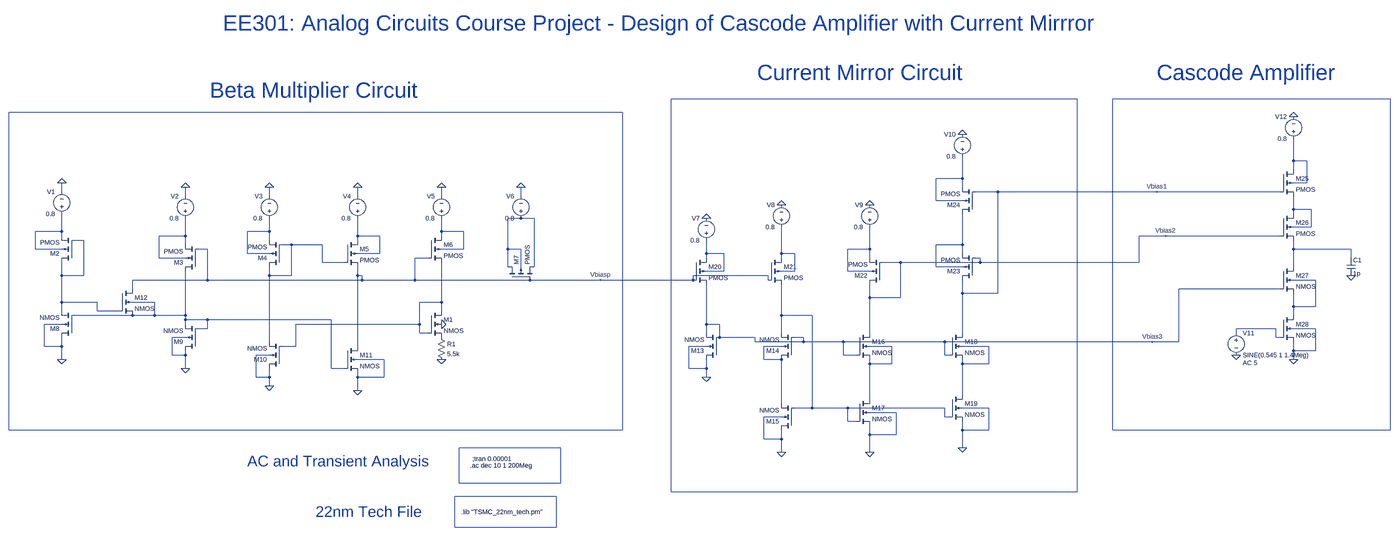
[diagram p0: schematic Cascode_Amplifier_Schematic_180nm.asc, whole sheet]
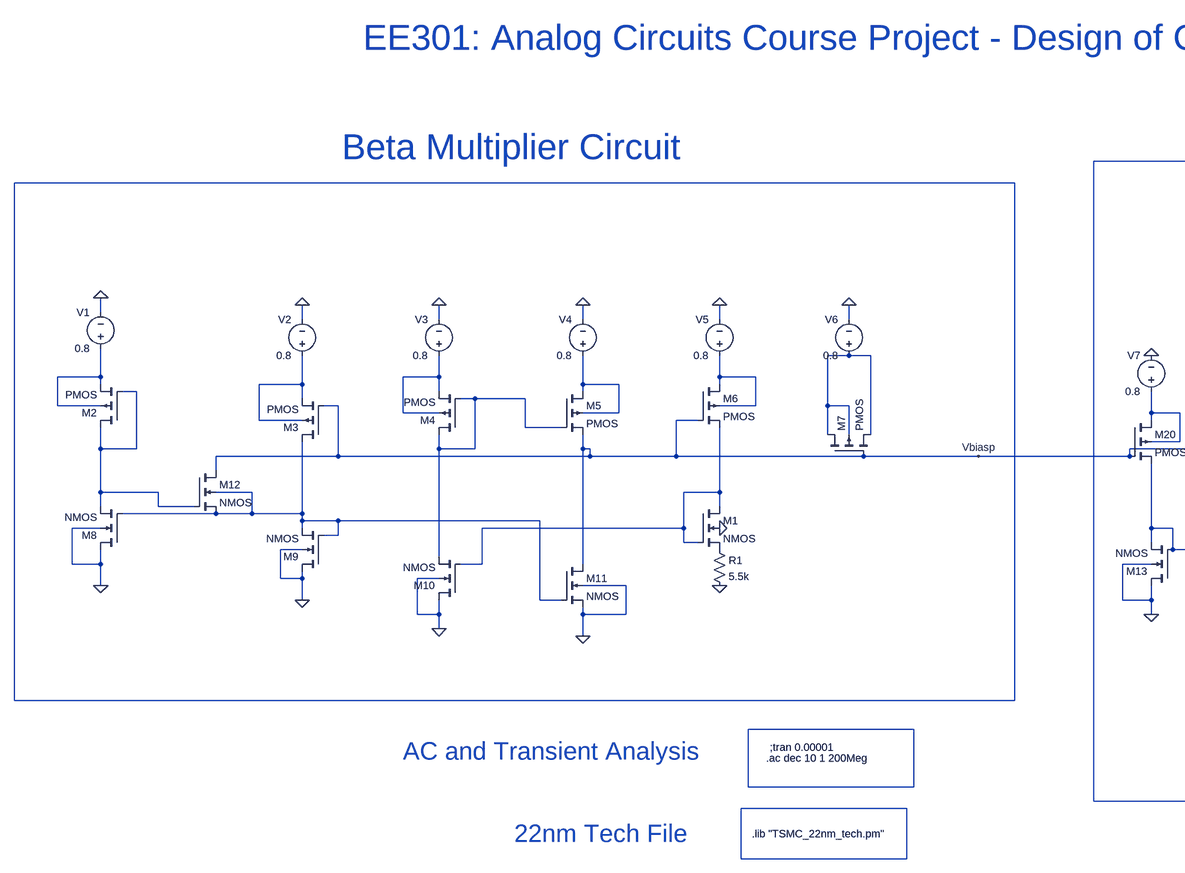
[diagram p1: schematic Cascode_Amplifier_Schematic_180nm.asc, part, row 1 of 1, column 1 of 2]
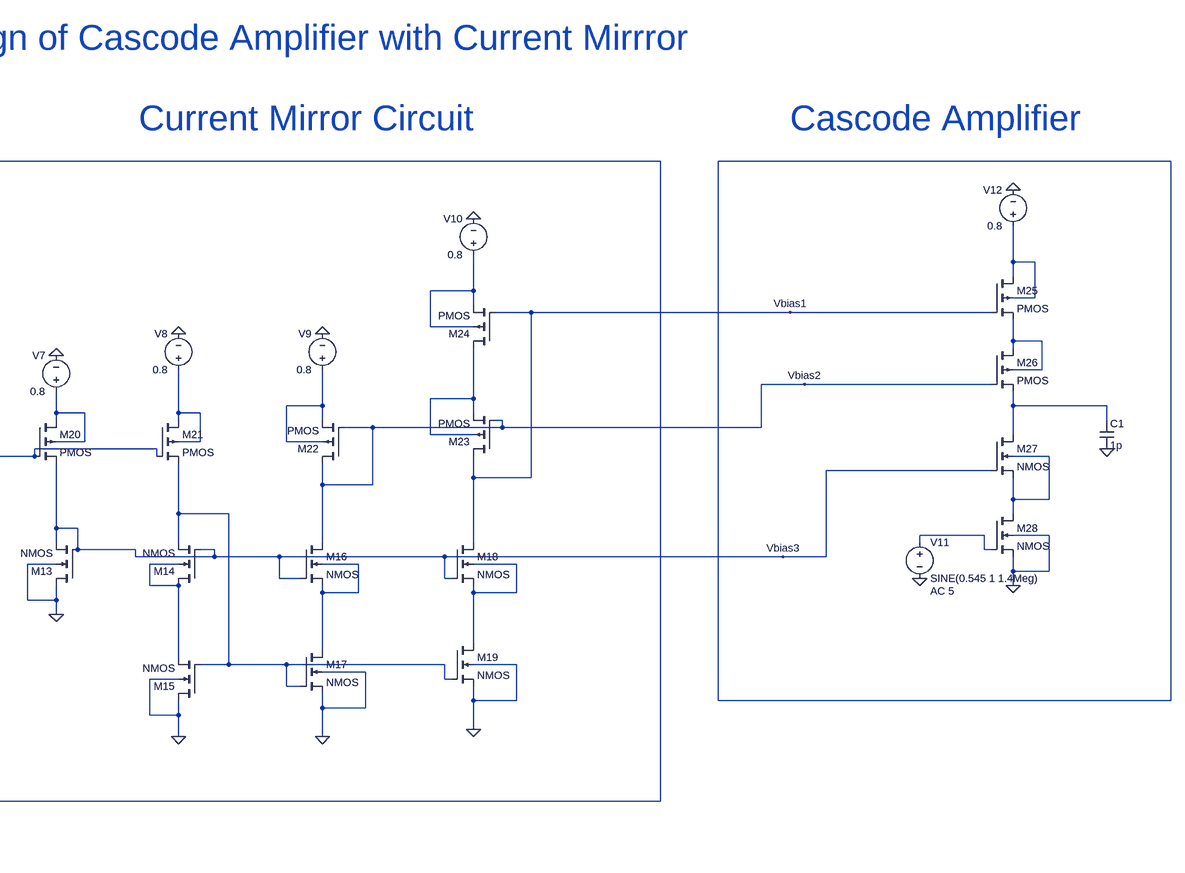
[diagram p2: schematic Cascode_Amplifier_Schematic_180nm.asc, part, row 1 of 1, column 2 of 2]
Cascode_Amplifier_Schematic_180nm.asc, the LTspice schematic file:
Version 4
SHEET 1 2628 1124
WIRE 1456 -432 -16 -432
WIRE 2624 -432 1584 -432
WIRE -192 -384 -2416 -384
WIRE 2240 -208 2240 -288
WIRE 2288 -208 2240 -208
WIRE 2240 -176 2240 -208
WIRE 1040 -144 1040 -224
WIRE 1040 -144 944 -144
WIRE 2288 -128 2288 -208
WIRE 2288 -128 2240 -128
WIRE 1040 -112 1040 -144
WIRE -2224 -96 -2224 -128
WIRE 1168 -96 1088 -96
WIRE 1744 -96 1168 -96
WIRE 2192 -96 1744 -96
WIRE -1776 -80 -1776 -112
WIRE -1472 -80 -1472 -112
WIRE -1152 -80 -1152 -112
WIRE -848 -80 -848 -112
WIRE -560 -80 -560 -112
WIRE 944 -64 944 -144
WIRE 1040 -64 944 -64
WIRE 2240 -32 2240 -80
WIRE 2304 -32 2240 -32
WIRE 2240 -16 2240 -32
WIRE -560 0 -608 0
WIRE -512 0 -560 0
WIRE 2304 32 2304 -32
WIRE 2304 32 2240 32
WIRE -2224 48 -2224 -16
WIRE -2224 48 -2320 48
WIRE -1472 48 -1472 0
WIRE -1472 48 -1552 48
WIRE -848 48 -848 0
WIRE -768 48 -848 48
WIRE -2224 64 -2224 48
WIRE -1776 64 -1776 0
WIRE -1776 64 -1872 64
WIRE -1152 64 -1152 0
WIRE -1072 64 -1152 64
WIRE -848 64 -848 48
WIRE 1776 64 1680 64
WIRE 2192 64 1776 64
WIRE -2144 80 -2176 80
WIRE -1472 80 -1472 48
WIRE -1152 80 -1152 64
WIRE -1776 96 -1776 64
WIRE -1392 96 -1424 96
WIRE -1280 96 -1392 96
WIRE 1040 96 1040 -16
WIRE 1040 96 944 96
WIRE -2320 112 -2320 48
WIRE -2224 112 -2320 112
WIRE -1696 112 -1728 112
WIRE -768 112 -768 48
WIRE -768 112 -848 112
WIRE -608 112 -608 0
WIRE -560 112 -608 112
WIRE 704 112 704 32
WIRE 704 112 624 112
WIRE 2240 112 2240 80
WIRE 2448 112 2240 112
WIRE -1552 128 -1552 48
WIRE -1472 128 -1552 128
WIRE -1072 128 -1072 64
WIRE -1072 128 -1152 128
WIRE 112 128 112 80
WIRE 176 128 112 128
WIRE 384 128 384 32
WIRE 432 128 384 128
WIRE 1040 128 1040 96
WIRE -1872 144 -1872 64
WIRE -1776 144 -1872 144
WIRE -896 144 -944 144
WIRE 112 144 112 128
WIRE 384 144 384 128
WIRE 704 144 704 112
WIRE 1104 144 1088 144
WIRE 2448 144 2448 112
WIRE -1280 160 -1280 96
WIRE -1200 160 -1280 160
WIRE 816 160 752 160
WIRE 1104 160 1104 144
WIRE 1104 160 816 160
WIRE 1680 160 1680 64
WIRE 1680 160 1104 160
WIRE -608 176 -608 112
WIRE -560 176 -560 112
WIRE -512 176 -512 0
WIRE 944 176 944 96
WIRE 1040 176 944 176
WIRE 2240 176 2240 112
WIRE 176 192 176 128
WIRE 176 192 112 192
WIRE 432 192 432 128
WIRE 432 192 384 192
WIRE 624 192 624 112
WIRE 704 192 624 192
WIRE -2224 208 -2224 160
WIRE -2144 208 -2144 80
WIRE -2144 208 -2224 208
WIRE -1472 208 -1472 176
WIRE -1392 208 -1392 96
WIRE -1392 208 -1472 208
WIRE -1152 208 -1152 176
WIRE -1136 208 -1152 208
WIRE 336 208 64 208
WIRE -1696 224 -1696 112
WIRE -1696 224 -1968 224
WIRE -1136 224 -1136 208
WIRE -1136 224 -1696 224
WIRE -944 224 -944 144
WIRE -944 224 -1136 224
WIRE -528 224 -944 224
WIRE -272 224 -528 224
WIRE 64 224 64 208
WIRE 64 224 -272 224
WIRE 336 224 336 208
WIRE 2320 224 2240 224
WIRE -1968 256 -1968 224
WIRE 2192 256 1824 256
WIRE 1040 272 1040 224
WIRE 1168 272 1168 -96
WIRE 1168 272 1040 272
WIRE 704 288 704 240
WIRE 816 288 816 160
WIRE 816 288 704 288
WIRE -2224 304 -2224 208
WIRE -2096 304 -2224 304
WIRE -1888 304 -1968 304
WIRE -848 304 -848 160
WIRE -848 304 -928 304
WIRE 2240 320 2240 272
WIRE 2320 320 2320 224
WIRE 2320 320 2240 320
WIRE -2224 336 -2224 304
WIRE -2096 336 -2096 304
WIRE -2016 336 -2096 336
WIRE -848 336 -848 304
WIRE -1968 352 -2176 352
WIRE -1888 352 -1888 304
WIRE -1888 352 -1968 352
WIRE -1776 352 -1776 192
WIRE -1776 352 -1888 352
WIRE 384 352 384 240
WIRE 496 352 384 352
WIRE 2240 352 2240 320
WIRE -1776 368 -1776 352
WIRE -1696 368 -1776 368
WIRE -1248 368 -1696 368
WIRE -2224 384 -2288 384
WIRE -1776 384 -1776 368
WIRE -928 384 -928 304
WIRE -928 384 -1376 384
WIRE 112 384 112 240
WIRE 160 384 112 384
WIRE -1696 400 -1696 368
WIRE -1696 400 -1728 400
WIRE 2176 400 2032 400
WIRE 2320 400 2240 400
WIRE -928 416 -928 384
WIRE -896 416 -928 416
WIRE 112 416 112 384
WIRE 384 416 384 352
WIRE 704 416 704 288
WIRE 1040 416 1040 272
WIRE 2032 416 2032 400
WIRE -1776 432 -1824 432
WIRE 160 432 160 384
WIRE 288 432 160 432
WIRE 464 432 432 432
WIRE 2176 432 2176 400
WIRE 2192 432 2176 432
WIRE -1472 448 -1472 208
WIRE 288 448 288 432
WIRE 464 448 464 432
WIRE 464 448 288 448
WIRE 608 448 464 448
WIRE 976 448 608 448
WIRE 1728 448 976 448
WIRE 1824 448 1824 256
WIRE 1824 448 1728 448
WIRE -2288 464 -2288 384
WIRE -2224 464 -2224 432
WIRE -2224 464 -2288 464
WIRE -1376 464 -1376 384
WIRE -1376 464 -1424 464
WIRE -1152 464 -1152 208
WIRE 112 464 48 464
WIRE 384 464 320 464
WIRE 784 464 704 464
WIRE 1136 464 1040 464
WIRE 2240 480 2240 448
WIRE 2320 480 2320 400
WIRE 2320 480 2240 480
WIRE -1824 496 -1824 432
WIRE -1776 496 -1776 480
WIRE -1776 496 -1824 496
WIRE -1472 496 -1520 496
WIRE 608 496 608 448
WIRE 656 496 608 496
WIRE 976 496 976 448
WIRE 992 496 976 496
WIRE -2224 512 -2224 464
WIRE -1056 512 -1152 512
WIRE 320 512 320 464
WIRE 384 512 320 512
WIRE 2240 512 2240 480
WIRE 704 528 704 512
WIRE 784 528 784 464
WIRE 784 528 704 528
WIRE 1040 528 1040 512
WIRE 1136 528 1136 464
WIRE 1136 528 1040 528
WIRE -1776 544 -1776 496
WIRE -1248 544 -1248 368
WIRE -1200 544 -1248 544
WIRE 48 544 48 464
WIRE 112 544 112 512
WIRE 112 544 48 544
WIRE -1520 576 -1520 496
WIRE -1472 576 -1472 544
WIRE -1472 576 -1520 576
WIRE -1152 576 -1152 560
WIRE -1056 576 -1056 512
WIRE -1056 576 -1152 576
WIRE 112 576 112 544
WIRE -1472 608 -1472 576
WIRE -1152 624 -1152 576
WIRE 1040 640 1040 528
WIRE 704 656 704 528
WIRE 384 672 384 512
WIRE 496 688 496 352
WIRE 496 688 432 688
WIRE 624 688 496 688
WIRE 976 688 624 688
WIRE 1136 688 1040 688
WIRE 800 704 704 704
WIRE 384 720 320 720
WIRE 976 720 976 688
WIRE 992 720 976 720
WIRE 624 736 624 688
WIRE 656 736 624 736
WIRE -2416 768 -2416 -384
WIRE -192 768 -192 -384
WIRE -192 768 -2416 768
WIRE 1040 768 1040 736
WIRE 1136 768 1136 688
WIRE 1136 768 1040 768
WIRE 1584 768 1584 -432
WIRE 2624 768 2624 -432
WIRE 2624 768 1584 768
WIRE 704 784 704 752
WIRE 800 784 800 704
WIRE 800 784 704 784
WIRE 320 800 320 720
WIRE 384 800 384 768
WIRE 384 800 320 800
WIRE -416 832 -784 832
WIRE 1040 832 1040 768
WIRE 384 848 384 800
WIRE 704 848 704 784
WIRE -784 960 -784 832
WIRE -416 960 -416 832
WIRE -416 960 -784 960
WIRE -16 992 -16 -432
WIRE 1456 992 1456 -432
WIRE 1456 992 -16 992
WIRE -432 1008 -800 1008
WIRE -800 1120 -800 1008
WIRE -432 1120 -432 1008
WIRE -432 1120 -800 1120
FLAG -2224 -128 0
FLAG -848 512 0
FLAG -1776 -112 0
FLAG -1472 -112 0
FLAG -1152 -112 0
FLAG -848 -112 0
FLAG -560 -112 0
FLAG -848 384 0
FLAG -2224 512 0
FLAG -1776 544 0
FLAG -1472 608 0
FLAG -1152 624 0
FLAG 112 576 0
FLAG 384 848 0
FLAG 704 848 0
FLAG 1040 832 0
FLAG 112 0 0
FLAG 384 -48 0
FLAG 704 -48 0
FLAG 1040 -304 0
FLAG 2240 512 0
FLAG 2032 496 0
FLAG 2240 -368 0
FLAG 2448 208 0
FLAG -272 224 Vbiasp
FLAG 1744 -96 Vbias1
FLAG 1776 64 Vbias2
FLAG 1728 448 Vbias3
SYMBOL voltage -2224 0 R180
WINDOW 0 24 96 Left 2
WINDOW 3 24 16 Left 2
WINDOW 123 0 0 Left 0
WINDOW 39 0 0 Left 0
SYMATTR InstName V1
SYMATTR Value 0.8
SYMBOL res -864 416 R0
SYMATTR InstName R1
SYMATTR Value 5.5k
SYMBOL voltage -1776 16 R180
WINDOW 0 24 96 Left 2
WINDOW 3 24 16 Left 2
WINDOW 123 0 0 Left 0
WINDOW 39 0 0 Left 0
SYMATTR InstName V2
SYMATTR Value 0.8
SYMBOL voltage -1472 16 R180
WINDOW 0 24 96 Left 2
WINDOW 3 24 16 Left 2
WINDOW 123 0 0 Left 0
WINDOW 39 0 0 Left 0
SYMATTR InstName V3
SYMATTR Value 0.8
SYMBOL voltage -1152 16 R180
WINDOW 0 24 96 Left 2
WINDOW 3 24 16 Left 2
WINDOW 123 0 0 Left 0
WINDOW 39 0 0 Left 0
SYMATTR InstName V4
SYMATTR Value 0.8
SYMBOL voltage -848 16 R180
WINDOW 0 24 96 Left 2
WINDOW 3 24 16 Left 2
WINDOW 123 0 0 Left 0
WINDOW 39 0 0 Left 0
SYMATTR InstName V5
SYMATTR Value 0.8
SYMBOL voltage -560 16 R180
WINDOW 0 24 96 Left 2
WINDOW 3 24 16 Left 2
WINDOW 123 0 0 Left 0
WINDOW 39 0 0 Left 0
SYMATTR InstName V6
SYMATTR Value 0.8
SYMBOL nmos4 -896 336 R0
SYMATTR InstName M1
SYMATTR Value2 l=44n w=660n
SYMBOL pmos4 -2176 160 R180
SYMATTR InstName M2
SYMATTR Value2 l=440n w=220n
SYMBOL pmos4 -1728 192 R180
SYMATTR InstName M3
SYMATTR Value2 l=44n w=528n
SYMBOL pmos4 -1424 176 R180
SYMATTR InstName M4
SYMATTR Value2 l=44n w=528n
SYMBOL pmos4 -1200 80 R0
SYMATTR InstName M5
SYMATTR Value2 l=44n w=528n
SYMBOL pmos4 -896 64 R0
SYMATTR InstName M6
SYMATTR Value2 l=44n w=528n
SYMBOL pmos4 -608 224 R270
SYMATTR InstName M7
SYMATTR Value2 l=1100n w=1100n
SYMBOL nmos4 -2176 432 R180
SYMATTR InstName M8
SYMATTR Value2 l=44n w=220n
SYMBOL nmos4 -1728 480 R180
SYMATTR InstName M9
SYMATTR Value2 l=44n w=220n
SYMBOL nmos4 -1424 544 R180
SYMATTR InstName M10
SYMATTR Value2 l=44n w=220n
SYMBOL nmos4 -1200 464 R0
SYMATTR InstName M11
SYMATTR Value2 l=44n w=220n
SYMBOL nmos4 -2016 256 R0
SYMATTR InstName M12
SYMATTR Value2 l=44n w=88n
SYMBOL nmos4 160 512 R180
SYMATTR InstName M13
SYMATTR Value2 l=50n w=52n
SYMBOL nmos4 432 512 R180
SYMATTR InstName M14
SYMATTR Value2 l=44n w=220n
SYMBOL nmos4 432 768 R180
SYMATTR InstName M15
SYMATTR Value2 l=44n w=220n
SYMBOL nmos4 656 416 R0
SYMATTR InstName M16
SYMATTR Value2 l=44n w=440n
SYMBOL nmos4 656 656 R0
SYMATTR InstName M17
SYMATTR Value2 l=44n w=358n
SYMBOL nmos4 992 416 R0
SYMATTR InstName M18
SYMATTR Value2 l=164n w=120n
SYMBOL nmos4 992 640 R0
SYMATTR InstName M19
SYMATTR Value2 l=44n w=220n
SYMBOL pmos4 64 144 R0
SYMATTR InstName M20
SYMATTR Value2 l=44n w=528n
SYMBOL pmos4 336 144 R0
SYMATTR InstName M21
SYMATTR Value2 l=44n w=528n
SYMBOL pmos4 752 240 R180
SYMATTR InstName M22
SYMATTR Value2 l=110n w=640n
SYMBOL pmos4 1088 224 R180
SYMATTR InstName M23
SYMATTR Value2 l=20n w=928n
SYMBOL pmos4 1088 -16 R180
SYMATTR InstName M24
SYMATTR Value2 l=44n w=528n
SYMBOL voltage 112 96 R180
WINDOW 0 24 96 Left 2
WINDOW 3 24 16 Left 2
WINDOW 123 0 0 Left 0
WINDOW 39 0 0 Left 0
SYMATTR InstName V7
SYMATTR Value 0.8
SYMBOL voltage 384 48 R180
WINDOW 0 24 96 Left 2
WINDOW 3 24 16 Left 2
WINDOW 123 0 0 Left 0
WINDOW 39 0 0 Left 0
SYMATTR InstName V8
SYMATTR Value 0.8
SYMBOL voltage 704 48 R180
WINDOW 0 24 96 Left 2
WINDOW 3 24 16 Left 2
WINDOW 123 0 0 Left 0
WINDOW 39 0 0 Left 0
SYMATTR InstName V9
SYMATTR Value 0.8
SYMBOL voltage 1040 -208 R180
WINDOW 0 24 96 Left 2
WINDOW 3 24 16 Left 2
WINDOW 123 0 0 Left 0
WINDOW 39 0 0 Left 0
SYMATTR InstName V10
SYMATTR Value 0.8
SYMBOL cap 2432 144 R0
SYMATTR InstName C1
SYMATTR Value 1p
SYMBOL voltage 2032 400 R0
WINDOW 123 24 124 Left 2
WINDOW 39 0 0 Left 0
SYMATTR Value2 AC 5
SYMATTR InstName V11
SYMATTR Value SINE(0.545 1 1.4Meg)
SYMBOL voltage 2240 -272 R180
WINDOW 0 24 96 Left 2
WINDOW 3 24 16 Left 2
WINDOW 123 0 0 Left 0
WINDOW 39 0 0 Left 0
SYMATTR InstName V12
SYMATTR Value 0.8
SYMBOL pmos4 2192 -176 R0
SYMATTR InstName M25
SYMATTR Value2 l=22n w=288n
SYMBOL pmos4 2192 -16 R0
SYMATTR InstName M26
SYMATTR Value2 l=22n w=288n
SYMBOL nmos4 2192 176 R0
SYMATTR InstName M27
SYMATTR Value2 l=22n w=188n
SYMBOL nmos4 2192 352 R0
SYMATTR InstName M28
SYMATTR Value2 l=22n w=188n
TEXT -736 872 Left 2 !;tran 0.00001
TEXT -744 896 Left 2 !.ac dec 10 1 200Meg
TEXT -776 1064 Left 2 !.lib "TSMC_22nm_tech.pm"
TEXT -1688 -464 Left 6 ;Beta Multiplier Circuit
TEXT 296 -528 Left 6 ;Current Mirror Circuit
TEXT 1744 -528 Left 6 ;Cascode Amplifier
TEXT -1552 880 Left 5 ;AC and Transient Analysis
TEXT -1304 1064 Left 5 ;22nm Tech File
TEXT -1640 -792 Left 6 ;EE301: Analog Circuits Course Project - Design of Cascode Amplifier with Current Mirrror

The netlist it stands for:
* Cascode_Amplifier_Schematic_180nm.asc
V1 N008 0 0.8
R1 P001 0 5.5k
V2 N011 0 0.8
V3 N009 0 0.8
V4 N012 0 0.8
V5 N010 0 0.8
V6 N007 0 0.8
M1 N022 N022 P001 0 NMOS l=44n w=660n
M2 N013 N013 N008 N008 PMOS l=440n w=220n
M3 N021 Vbiasp N011 N011 PMOS l=44n w=528n
M4 N014 N014 N009 N009 PMOS l=44n w=528n
M5 N012 N014 Vbiasp N012 PMOS l=44n w=528n
M6 N010 Vbiasp N022 N010 PMOS l=44n w=528n
M7 N007 Vbiasp N007 N007 PMOS l=1100n w=1100n
M8 0 N021 N013 0 NMOS l=44n w=220n
M9 0 N021 N021 0 NMOS l=44n w=220n
M10 0 N022 N014 0 NMOS l=44n w=220n
M11 Vbiasp N021 0 0 NMOS l=44n w=220n
M12 Vbiasp N013 N021 N021 NMOS l=44n w=88n
M13 0 Vbias3 Vbias3 0 NMOS l=50n w=52n
M14 N025 Vbias3 N023 N025 NMOS l=44n w=220n
M15 0 N023 N025 0 NMOS l=44n w=220n
M16 Vbias2 Vbias3 N026 N026 NMOS l=44n w=440n
M17 N026 N023 0 0 NMOS l=44n w=358n
M18 Vbias1 Vbias3 N027 N027 NMOS l=164n w=120n
M19 N027 N023 0 0 NMOS l=44n w=220n
M20 N018 Vbiasp Vbias3 N018 PMOS l=44n w=528n
M21 N019 Vbiasp N023 N019 PMOS l=44n w=528n
M22 Vbias2 Vbias2 N016 N016 PMOS l=110n w=640n
M23 Vbias1 Vbias2 N015 N015 PMOS l=20n w=928n
M24 N015 Vbias1 N005 N005 PMOS l=44n w=528n
V7 N018 0 0.8
V8 N019 0 0.8
V9 N016 0 0.8
V10 N005 0 0.8
C1 N017 0 1p
V11 N024 0 SINE(0.545 1 1.4Meg) AC 5
V12 N004 0 0.8
M25 N004 Vbias1 N006 N004 PMOS l=22n w=288n
M26 N006 Vbias2 N017 N006 PMOS l=22n w=288n
M27 N017 Vbias3 N020 N020 NMOS l=22n w=188n
M28 N020 N024 0 0 NMOS l=22n w=188n
.model NMOS NMOS
.model PMOS PMOS
.lib standard.mos
;tran 0.00001
.ac dec 10 1 200Meg
.lib "TSMC_22nm_tech.pm"
* Beta Multiplier Circuit
* Current Mirror Circuit
* Cascode Amplifier
* AC and Transient Analysis
* 22nm Tech File
* EE301: Analog Circuits Course Project - Design of Cascode Amplifier with Current Mirrror
.backanno
.end